# Altium project SCOM_CCM_JLC_STACKUP.PrjPcb
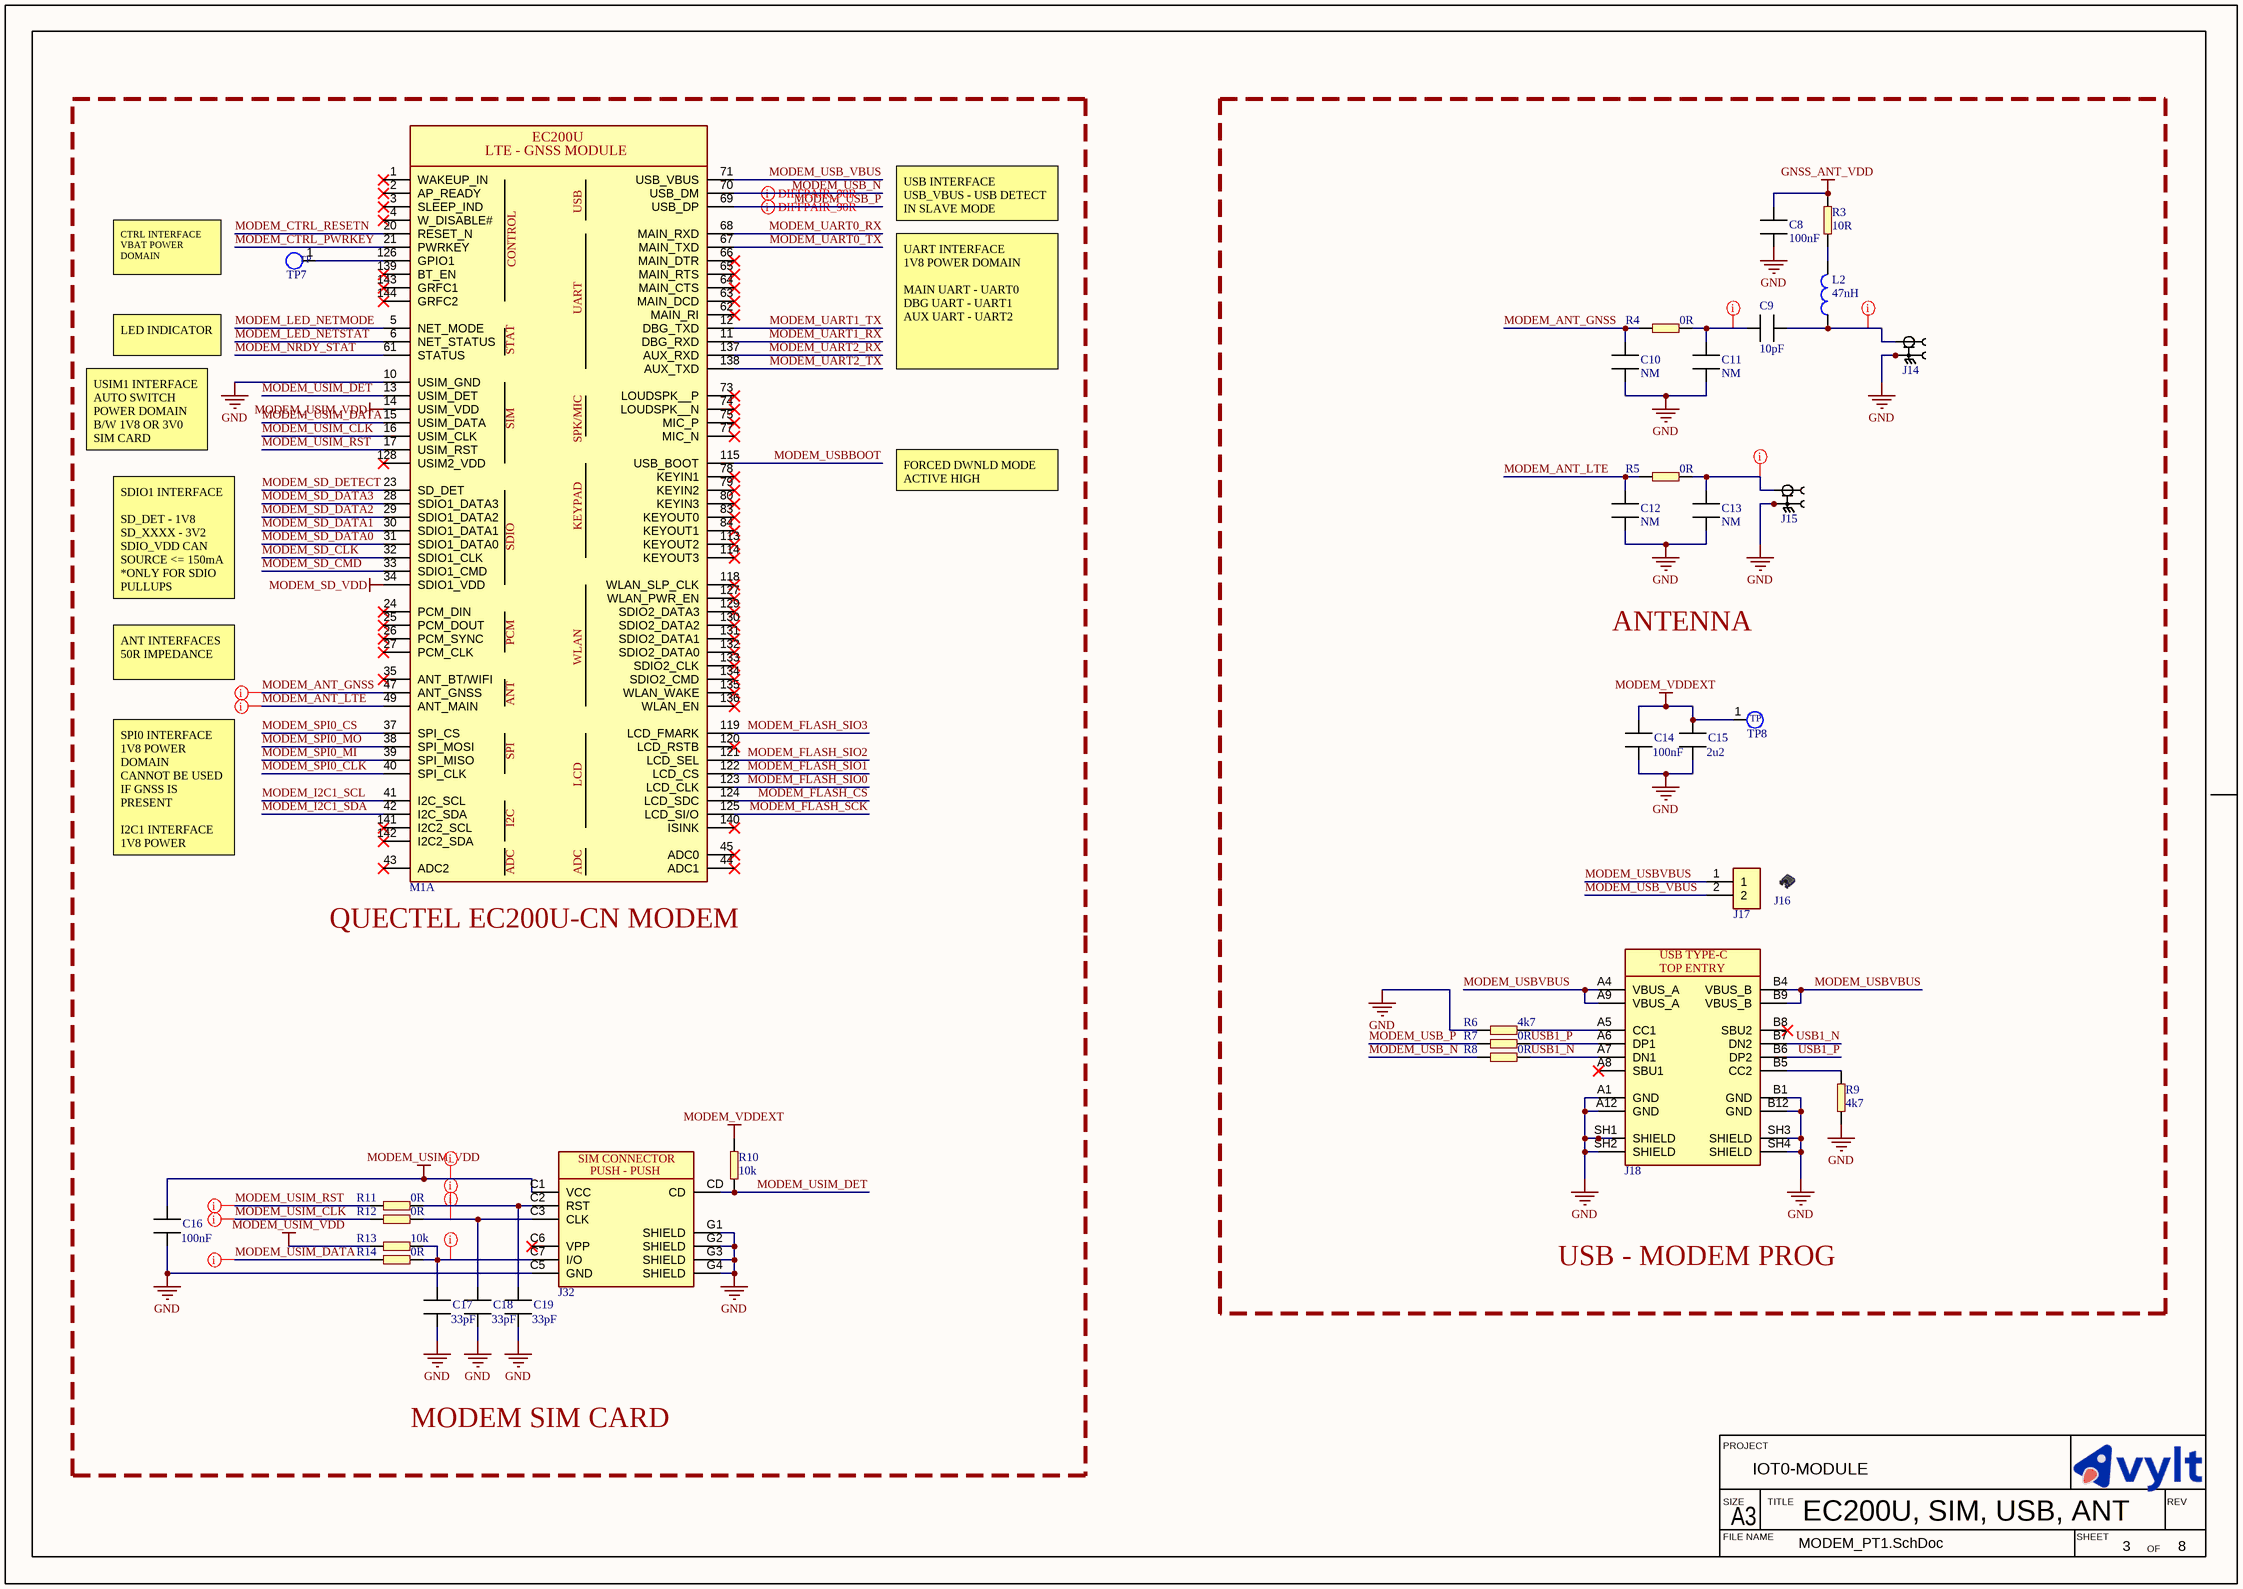
[diagram p0: MODEM_PT1.SchDoc]
Project: IOT0-MODULE; Rev: 1.0; SheetTotal: 8
3 sheets, 82 parts. Net scope: global (net labels, ports and power ports of the same name join across sheets).
Board file: SCOM_CCM_JLC_STACKUP.PcbDoc
Sheets:
  MODEM_PT1.SchDoc
  STORAGE.SchDoc
  MCU.SchDoc

## Sheet MODEM_PT1.SchDoc: EC200U, SIM, USB, ANT
size 420 x 297 mm; Revision: 1.0; SheetNumber: 3

### Parts
C8  value 100nF  [CAPC2012X13L]  (hidden comment: MLCC_0805)  (no BOM)
C9  value 10pF  [CAPC0603X03L]  (hidden comment: ERP_102-1)
C10  value NM  [CAPC0603X03L]  (hidden comment: ERP_102-1)  (no BOM)
C11  value NM  [CAPC0603X03L]  (hidden comment: ERP_102-1)  (no BOM)
C12  value NM  [CAPC0603X03L]  (hidden comment: ERP_102-1)  (no BOM)
C13  value NM  [CAPC0603X03L]  (hidden comment: ERP_102-1)  (no BOM)
C14  value 100nF  [CAPC2012X13L]  (hidden comment: MLCC_0805)
C15  value 2u2  [CAPC2012X13L]  (hidden comment: MLCC_0805)
C16  value 100nF  [CAPC2012X13L]  (hidden comment: MLCC_0805)
C17  value 33pF  [CAPC2012X13L]  (hidden comment: MLCC_0805)
C18  value 33pF  [CAPC2012X13L]  (hidden comment: MLCC_0805)
C19  value 33pF  [CAPC2012X13L]  (hidden comment: MLCC_0805)
J14  ERP_148-1  [uFL_50R]  (value not drawn)
J15  ERP_148-1  [uFL_50R]  (value not drawn)
J16  Jumper Cap  (value not drawn)  (mechanical)
J17  2PX1R  [2PX1R]  (value not drawn)
J18  GSB1CA11101DSHR  [GSB1CA11101DSHR]  (value not drawn)
J32  MUP-7801-1  [MUP-7801-1]  (value not drawn)
L2  value 47nH  [IND_0603]  (hidden comment: ERP_103-3)
M1  EC200U  [EC200U]  (value not drawn)  (part A of 2)
R3  value 10R  [RES_0603]  (hidden comment: ERP_101-1)
R4  value 0R  [RESC0603X03L]  (hidden comment: ERP_101-1)
R5  value 0R  [RESC0603X03L]  (hidden comment: ERP_101-1)
R6  value 4k7  [RES_0603]  (hidden comment: ERP_101-1)
R7  value 0R  [RES_0603]  (hidden comment: ERP_101-1)
R8  value 0R  [RES_0603]  (hidden comment: ERP_101-1)
R9  value 4k7  [RES_0603]  (hidden comment: ERP_101-1)
R10  value 10k  [RES_0603]  (hidden comment: ERP_101-1)
R11  value 0R  [RES_0603]  (hidden comment: ERP_101-1)
R12  value 0R  [RES_0603]  (hidden comment: ERP_101-1)
R13  value 10k  [RES_0603]  (hidden comment: ERP_101-1)
R14  value 0R  [RES_0603]  (hidden comment: ERP_101-1)
TP7  TP_1MM  [TP_1MM]  (value not drawn)  (no BOM)
TP8  TP_1MM  [TP_1MM]  (value not drawn)  (no BOM)

### Nets
GND: C8.2 C10.1 C11.1 C12.1 C13.1 C14.2 C15.2 C16.2 C17.2 C18.2 C19.2 J14.1 J14.2 J15.1 J15.2 J18.A1(GND) J18.A12(GND) J18.B1(GND) J18.B12(GND) J18.SH1(SHIELD) J18.SH2(SHIELD) J18.SH3(SHIELD) J18.SH4(SHIELD) J32.C5(GND) J32.G1(SHIELD) J32.G2(SHIELD) J32.G3(SHIELD) J32.G4(SHIELD) M1.10(USIM_GND) R6.2 R9.2
GNSS_ANT_VDD: C8.1 R3.2
MODEM_SD_VDD: M1.34(SDIO1_VDD)
MODEM_USIM_VDD: C16.1 J32.C1(VCC) M1.14(USIM_VDD) R13.2
MODEM_VDDEXT: C14.1 C15.1 R10.2 TP8.1
MODEM_ANT_GNSS: C10.2 M1.47(ANT_GNSS) R4.2
MODEM_ANT_LTE: C12.2 M1.49(ANT_MAIN) R5.2
MODEM_CTRL_PWRKEY: M1.21(PWRKEY)
MODEM_CTRL_RESETN: M1.20(RESET_N)
MODEM_FLASH_CS: M1.124(LCD_SDC)
MODEM_FLASH_SCK: M1.125(LCD_SI/O)
MODEM_FLASH_SIO0: M1.123(LCD_CLK)
MODEM_FLASH_SIO1: M1.122(LCD_CS)
MODEM_FLASH_SIO2: M1.121(LCD_SEL)
MODEM_FLASH_SIO3: M1.119(LCD_FMARK)
MODEM_I2C1_SCL: M1.41(I2C_SCL)
MODEM_I2C1_SDA: M1.42(I2C_SDA)
MODEM_LED_NETMODE: M1.5(NET_MODE)
MODEM_LED_NETSTAT: M1.6(NET_STATUS)
MODEM_NRDY_STAT: M1.61(STATUS)
MODEM_SD_CLK: M1.32(SDIO1_CLK)
MODEM_SD_CMD: M1.33(SDIO1_CMD)
MODEM_SD_DATA0: M1.31(SDIO1_DATA0)
MODEM_SD_DATA1: M1.30(SDIO1_DATA1)
MODEM_SD_DATA2: M1.29(SDIO1_DATA2)
MODEM_SD_DATA3: M1.28(SDIO1_DATA3)
MODEM_SD_DETECT: M1.23(SD_DET)
MODEM_SPI0_CLK: M1.40(SPI_CLK)
MODEM_SPI0_CS: M1.37(SPI_CS)
MODEM_SPI0_MI: M1.39(SPI_MISO)
MODEM_SPI0_MO: M1.38(SPI_MOSI)
MODEM_UART0_RX: M1.68(MAIN_RXD)
MODEM_UART0_TX: M1.67(MAIN_TXD)
MODEM_UART1_RX: M1.11(DBG_RXD)
MODEM_UART1_TX: M1.12(DBG_TXD)
MODEM_UART2_RX: M1.137(AUX_RXD)
MODEM_UART2_TX: M1.138(AUX_TXD)
MODEM_USB_N: M1.70(USB_DM) R8.2
MODEM_USB_P: M1.69(USB_DP) R7.2
MODEM_USB_VBUS: J17.2 M1.71(USB_VBUS)
MODEM_USBBOOT: M1.115(USB_BOOT)
MODEM_USBVBUS: J17.1 J18.A4(VBUS_A) J18.A9(VBUS_A) J18.B4(VBUS_B) J18.B9(VBUS_B)
MODEM_USIM_CLK: M1.16(USIM_CLK) R12.2
MODEM_USIM_DATA: M1.15(USIM_DATA) R14.2
MODEM_USIM_DET: J32.CD M1.13(USIM_DET) R10.1
MODEM_USIM_RST: M1.17(USIM_RST) R11.2
USB1_N: J18.A7(DN1) J18.B7(DN2) R8.1
USB1_P: J18.A6(DP1) J18.B6(DP2) R7.1
NetC9_1: C9.1 J14.3 L2.1
NetC9_2: C9.2 C11.2 R4.1
NetC13_2: C13.2 J15.3 R5.1
NetC17_1: C17.1 J32.C7(I/O) R13.1 R14.1
NetC18_1: C18.1 J32.C3(CLK) R12.1
NetC19_1: C19.1 J32.C2(RST) R11.1
NetJ18_A5: J18.A5(CC1) R6.1
NetJ18_B5: J18.B5(CC2) R9.1
NetL2_2: L2.2 R3.1
NetM1_126: M1.126(GPIO1) TP7.1

Not connected (* = marked no-connect by the designer): J18 A8(SBU1)* B8(SBU2)*; J32 C6(VPP)*; M1 1(WAKEUP_IN)* 2(AP_READY)* 3(SLEEP_IND)* 4(W_DISABLE#)* 24(PCM_DIN)* 25(PCM_DOUT)* 26(PCM_SYNC)* 27(PCM_CLK)* 35(ANT_BT/WIFI)* 43(ADC2)* 44(ADC1)* 45(ADC0)* 62(MAIN_RI)* 63(MAIN_DCD)* 64(MAIN_CTS)* 65(MAIN_RTS)* 66(MAIN_DTR)* 73(LOUDSPK__P)* 74(LOUDSPK__N)* 75(MIC_P)* 77(MIC_N)* 78(KEYIN1)* 79(KEYIN2)* 80(KEYIN3)* 83(KEYOUT0)* 84(KEYOUT1)* 113(KEYOUT2)* 114(KEYOUT3)* 118(WLAN_SLP_CLK)* 120(LCD_RSTB)* 127(WLAN_PWR_EN)* 128(USIM2_VDD)* 129(SDIO2_DATA3)* 130(SDIO2_DATA2)* 131(SDIO2_DATA1)* 132(SDIO2_DATA0)* 133(SDIO2_CLK)* 134(SDIO2_CMD)* 135(WLAN_WAKE)* 136(WLAN_EN)* 139(BT_EN)* 140(ISINK)* 141(I2C2_SCL)* 142(I2C2_SDA)* 143(GRFC1)* 144(GRFC2)*

### Layout directives
differential pair; differential pair class USB_90R; rule Differential Pairs Routing [Pref Gap = 10mil    Min Gap  = 10mil    Max Gap  = 10milPref Width = 12.778mil    Min Width  = 12.778mil    Max Width  = 12.778mil]: MODEM_USB_N
differential pair; rule Differential Pairs Routing [Pref Gap = 10mil    Min Gap  = 10mil    Max Gap  = 10milPref Width = 12.778mil    Min Width  = 12.778mil    Max Width  = 12.778mil]; differential pair class USB_90R: MODEM_USB_P
net class ANT_50R; rule Width Constraint [Pref Impedance = 50.00ohms    Min Impedance = 50.00ohms    Max Impedance = 50.00ohms]: MODEM_ANT_GNSS, MODEM_ANT_LTE, NetC9_1, NetC9_2, NetC13_2
rule Width Constraint [Pref Impedance = 50.00ohms    Min Impedance = 50.00ohms    Max Impedance = 50.00ohms]: MODEM_USIM_CLK, MODEM_USIM_DATA, MODEM_USIM_RST, MODEM_USIM_VDD, NetC17_1, NetC18_1, NetC19_1

### Notes on the sheet
- USB INTERFACE
  USB_VBUS - USB DETECT IN SLAVE MODE
- CTRL INTERFACE
  VBAT POWER DOMAIN
- LED INDICATOR
- UART INTERFACE
  1V8 POWER DOMAIN
  MAIN UART - UART0
  DBG UART - UART1
  AUX UART - UART2
- USIM1 INTERFACE
  AUTO SWITCH POWER DOMAIN B/W 1V8 OR 3V0 SIM CARD
- FORCED DWNLD MODE
  ACTIVE HIGH
- SDIO1 INTERFACE
  SD_DET - 1V8
  SD_XXXX - 3V2
  SDIO_VDD CAN SOURCE <= 150mA
  *ONLY FOR SDIO PULLUPS
- ANTENNA
- ANT INTERFACES
  50R IMPEDANCE
- SPI0 INTERFACE
  1V8 POWER DOMAIN
  CANNOT BE USED IF GNSS IS PRESENT
  I2C1 INTERFACE
  1V8 POWER DOMAIN
- (near M1) QUECTEL EC200U-CN MODEM
- USB - MODEM PROG
- MODEM SIM CARD
- PROJECT
- SIZE
- FILE NAME
- A3
- TITLE
- SHEET
- OF
- REV
- (in symbol EC200U, part A) LTE - GNSS MODULE; USB; CONTROL; UART; STAT; SIM; SPK/MIC; KEYPAD; SDIO; PCM; WLAN; ANT; SPI; LCD; I2C; ADC
- (in symbol GSB1CA11101DSHR) USB TYPE-C; TOP ENTRY
- (in symbol MUP-7801-1) SIM CONNECTOR; PUSH - PUSH
- (in symbol TP_1MM) TP

### Library data of the parts
C8 C14-C19 = MLCC_0805: Chip Capacitor, 2-Leads, Body 2.00x1.25mm, IPC High Density; Package: 0805; Manufacturer 1: *; Manufacturer Part Number 1: *
C9-C13 = MLCC_0201: Chip Capacitor, 2-Leads, Body 0.60x0.30mm, IPC High Density; Package: 0201; Manufacturer 1: *; Manufacturer Part Number 1: *
J14 J15 = uFL_50R: Package: L3W3; Value: *; ERP: *; Manufacturer 1: *; Manufacturer Part Number 1: *; Supplier 1: *; Suuplier Part Number 1: *
J16 = Jumper Cap: 2 Pin Jumper Cap P2.54; Manufacturer Part Number 1: *; Manufacturer 1: *; Value: *
J18 = GSB1CA11101DSHR: USB-C (USB TYPE-C) USB 2.0 Receptacle Connector 24 (16+8 Dummy) Position Surface Mount, Through Hole; Manufacturer 1: Amphenol ICC (Commercial Products); Value: MUP-U23010-02; Manufacturer Part Number 1: GSB1CA11101DSHR; Package: 24 (16+8 Dummy)
J32 = MUP-7801-1: 7 (6 + 1) Position Card Connector NANO SIM Surface Mount, Right Angle Gold; Manufacturer Part Number 1: MUP-C7801-02; Manufacturer 1: MUP; Package: 7 (6 + 1); Value: *; Supplier Part Number 1: ST2103SD1921
L2 = IND_0603: ERP: *; Suuplier Part Number 1: *; Supplier 1: *; Manufacturer Part Number 1: *; Manufacturer 1: *; Package: 0603
M1 = EC200U: LTE CAT1 MODEM 144 SMD; Manufacturer 1: Quectel; Manufacturer Part Number 1: 027-EC200UCNAA-N05-SGNSA; Value: *
R3 R6-R14 = RES_0603: Package: 0603; Manufacturer 1: *; Manufacturer Part Number 1: *
R4 R5 = RES_0201: Package: 0201; Manufacturer 1: *; Manufacturer Part Number 1: *

## Sheet STORAGE.SchDoc: FLASH, SD CARD
size 420 x 297 mm; Revision: 1.0; SheetNumber: 5
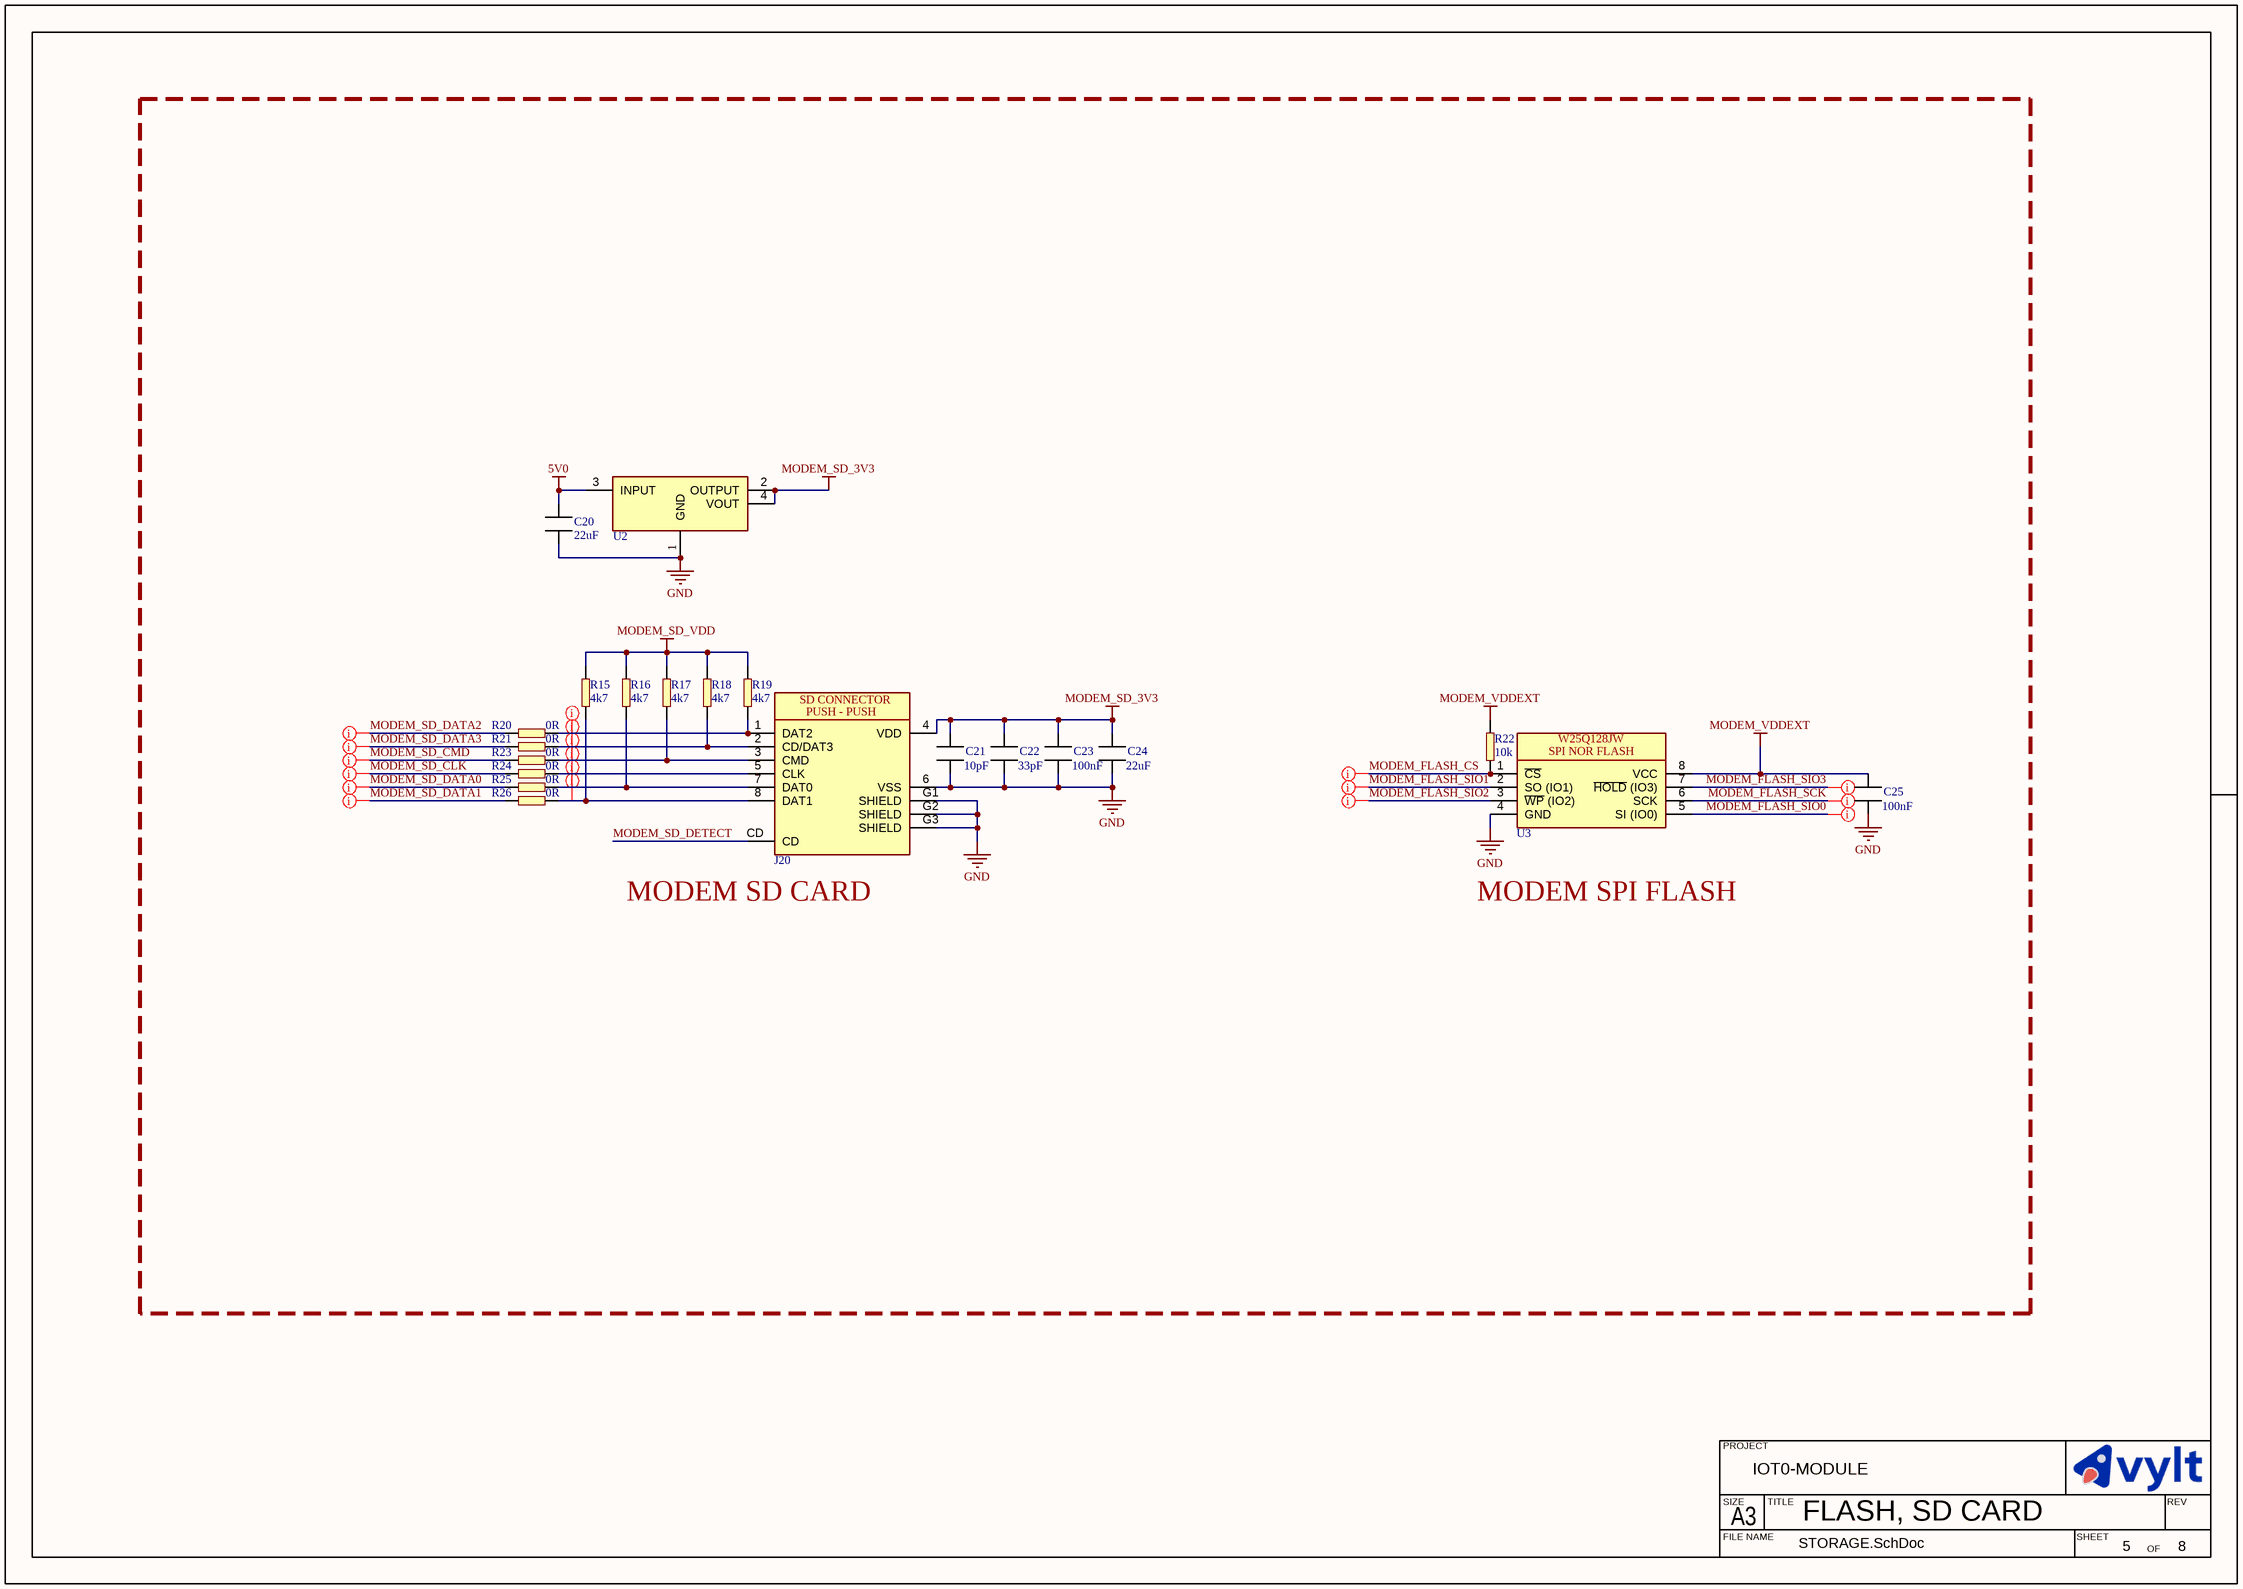
[diagram p1: STORAGE.SchDoc]

### Parts
C20  value 22uF  [CAPC2012X13L]  (hidden comment: MLCC_0805)
C21  value 10pF  [CAPC2012X13L]  (hidden comment: MLCC_0805)
C22  value 33pF  [CAPC2012X13L]  (hidden comment: MLCC_0805)
C23  value 100nF  [CAPC2012X13L]  (hidden comment: MLCC_0805)
C24  value 22uF  [CAPC2012X13L]  (hidden comment: MLCC_0805)
C25  value 100nF  [CAPC2012X13L]  (hidden comment: MLCC_0805)  (no BOM)
J20  GTFP084  [GTFP084]  (value not drawn)
R15  value 4k7  [RES_0603]  (hidden comment: ERP_101-1)
R16  value 4k7  [RES_0603]  (hidden comment: ERP_101-1)
R17  value 4k7  [RES_0603]  (hidden comment: ERP_101-1)
R18  value 4k7  [RES_0603]  (hidden comment: ERP_101-1)
R19  value 4k7  [RES_0603]  (hidden comment: ERP_101-1)
R20  value 0R  [RES_0603]  (hidden comment: ERP_101-1)  (no BOM)
R21  value 0R  [RES_0603]  (hidden comment: ERP_101-1)  (no BOM)
R22  value 10k  [RES_0603]  (hidden comment: ERP_101-1)  (no BOM)
R23  value 0R  [RES_0603]  (hidden comment: ERP_101-1)  (no BOM)
R24  value 0R  [RES_0603]  (hidden comment: ERP_101-1)  (no BOM)
R25  value 0R  [RES_0603]  (hidden comment: ERP_101-1)  (no BOM)
R26  value 0R  [RES_0603]  (hidden comment: ERP_101-1)  (no BOM)
U2  ERP_123-1  [AMS1117_SOT223]  (value not drawn)
U3  W25Q128JW  [SOIC127P800X216-8L]  (value not drawn)  (no BOM)

### Nets
5V0: C20.1 U2.3(INPUT)
GND: C20.2 C21.2 C22.2 C23.2 C24.2 C25.2 J20.6(VSS) J20.G1(SHIELD) J20.G2(SHIELD) J20.G3(SHIELD) U2.1(GND) U3.4(GND)
MODEM_SD_3V3: C21.1 C22.1 C23.1 C24.1 J20.4(VDD) U2.2(OUTPUT) U2.4(VOUT)
MODEM_SD_VDD: R15.2 R16.2 R17.2 R18.2 R19.2
MODEM_VDDEXT: C25.1 R22.2 U3.8(VCC)
MODEM_FLASH_CS: R22.1 U3.1(~{CS})
MODEM_FLASH_SCK: U3.6(SCK)
MODEM_FLASH_SIO0: U3.5(SI_(IO0))
MODEM_FLASH_SIO1: U3.2(SO_(IO1))
MODEM_FLASH_SIO2: U3.3(~{WP}_(IO2))
MODEM_FLASH_SIO3: U3.7(~{HOLD}_(IO3))
MODEM_SD_CLK: R24.2
MODEM_SD_CMD: R23.2
MODEM_SD_DATA0: R25.2
MODEM_SD_DATA1: R26.2
MODEM_SD_DATA2: R20.2
MODEM_SD_DATA3: R21.2
MODEM_SD_DETECT: J20.CD
NetJ20_1: J20.1(DAT2) R19.1 R20.1
NetJ20_2: J20.2(CD/DAT3) R18.1 R21.1
NetJ20_3: J20.3(CMD) R17.1 R23.1
NetJ20_5: J20.5(CLK) R24.1
NetJ20_7: J20.7(DAT0) R16.1 R25.1
NetJ20_8: J20.8(DAT1) R15.1 R26.1

### Layout directives
rule Width Constraint [Pref Impedance = 50.00ohms    Min Impedance = 50.00ohms    Max Impedance = 50.00ohms]: MODEM_FLASH_CS, MODEM_FLASH_SCK, MODEM_FLASH_SIO0, MODEM_FLASH_SIO1, MODEM_FLASH_SIO2, MODEM_FLASH_SIO3, MODEM_SD_CLK, MODEM_SD_CMD, MODEM_SD_DATA0, MODEM_SD_DATA1, MODEM_SD_DATA2, MODEM_SD_DATA3, NetJ20_1, NetJ20_2, NetJ20_3, NetJ20_5, NetJ20_7, NetJ20_8

### Notes on the sheet
- (near J20) MODEM SD CARD
- MODEM SPI FLASH
- PROJECT
- SIZE
- FILE NAME
- A3
- TITLE
- SHEET
- OF
- REV
- (in symbol GTFP084) SD CONNECTOR; PUSH - PUSH
- (in symbol W25Q128JW) SPI NOR FLASH

### Library data of the parts
C20-C25 = MLCC_0805: as C8 on sheet MODEM_PT1; Package: 0805; Manufacturer 1: *; Manufacturer Part Number 1: *
J20 = GTFP084: 9 (8 + 1) Position Card Connector Secure Digital - microSD™ Surface Mount, Right Angle Gold; Manufacturer Part Number 1: GTFP08431BEU; Manufacturer 1: Amphenol; Package: 9 (8+1); Value: *; Supplier Part Number 1: 6172
R15-R26 = RES_0603: Package: 0603; Manufacturer 1: *; Manufacturer Part Number 1: *
U2 = AMS1117_SOT223: AMS1117 LDO; Manufacturer 1: TI; Supplier  Part Number 1: *; Supplier  1: *; Package: SOT223; Manufacturer Part Number 1: *
U3 = W25Q128JW: FLASH - NOR Memory IC SPI - Quad I/O 133 MHz 8-SOIC; Manufacturer 1: Winbond; Manufacturer Part Number 1: W25Q128JWSIQ; Package: 8-SOIC; Value: *; Supplier Part Number 1: 153-W25Q128JWSIQ

## Sheet MCU.SchDoc: ESP32-PICO, STM32F4
size 420 x 297 mm; Revision: 1.0; SheetNumber: 6
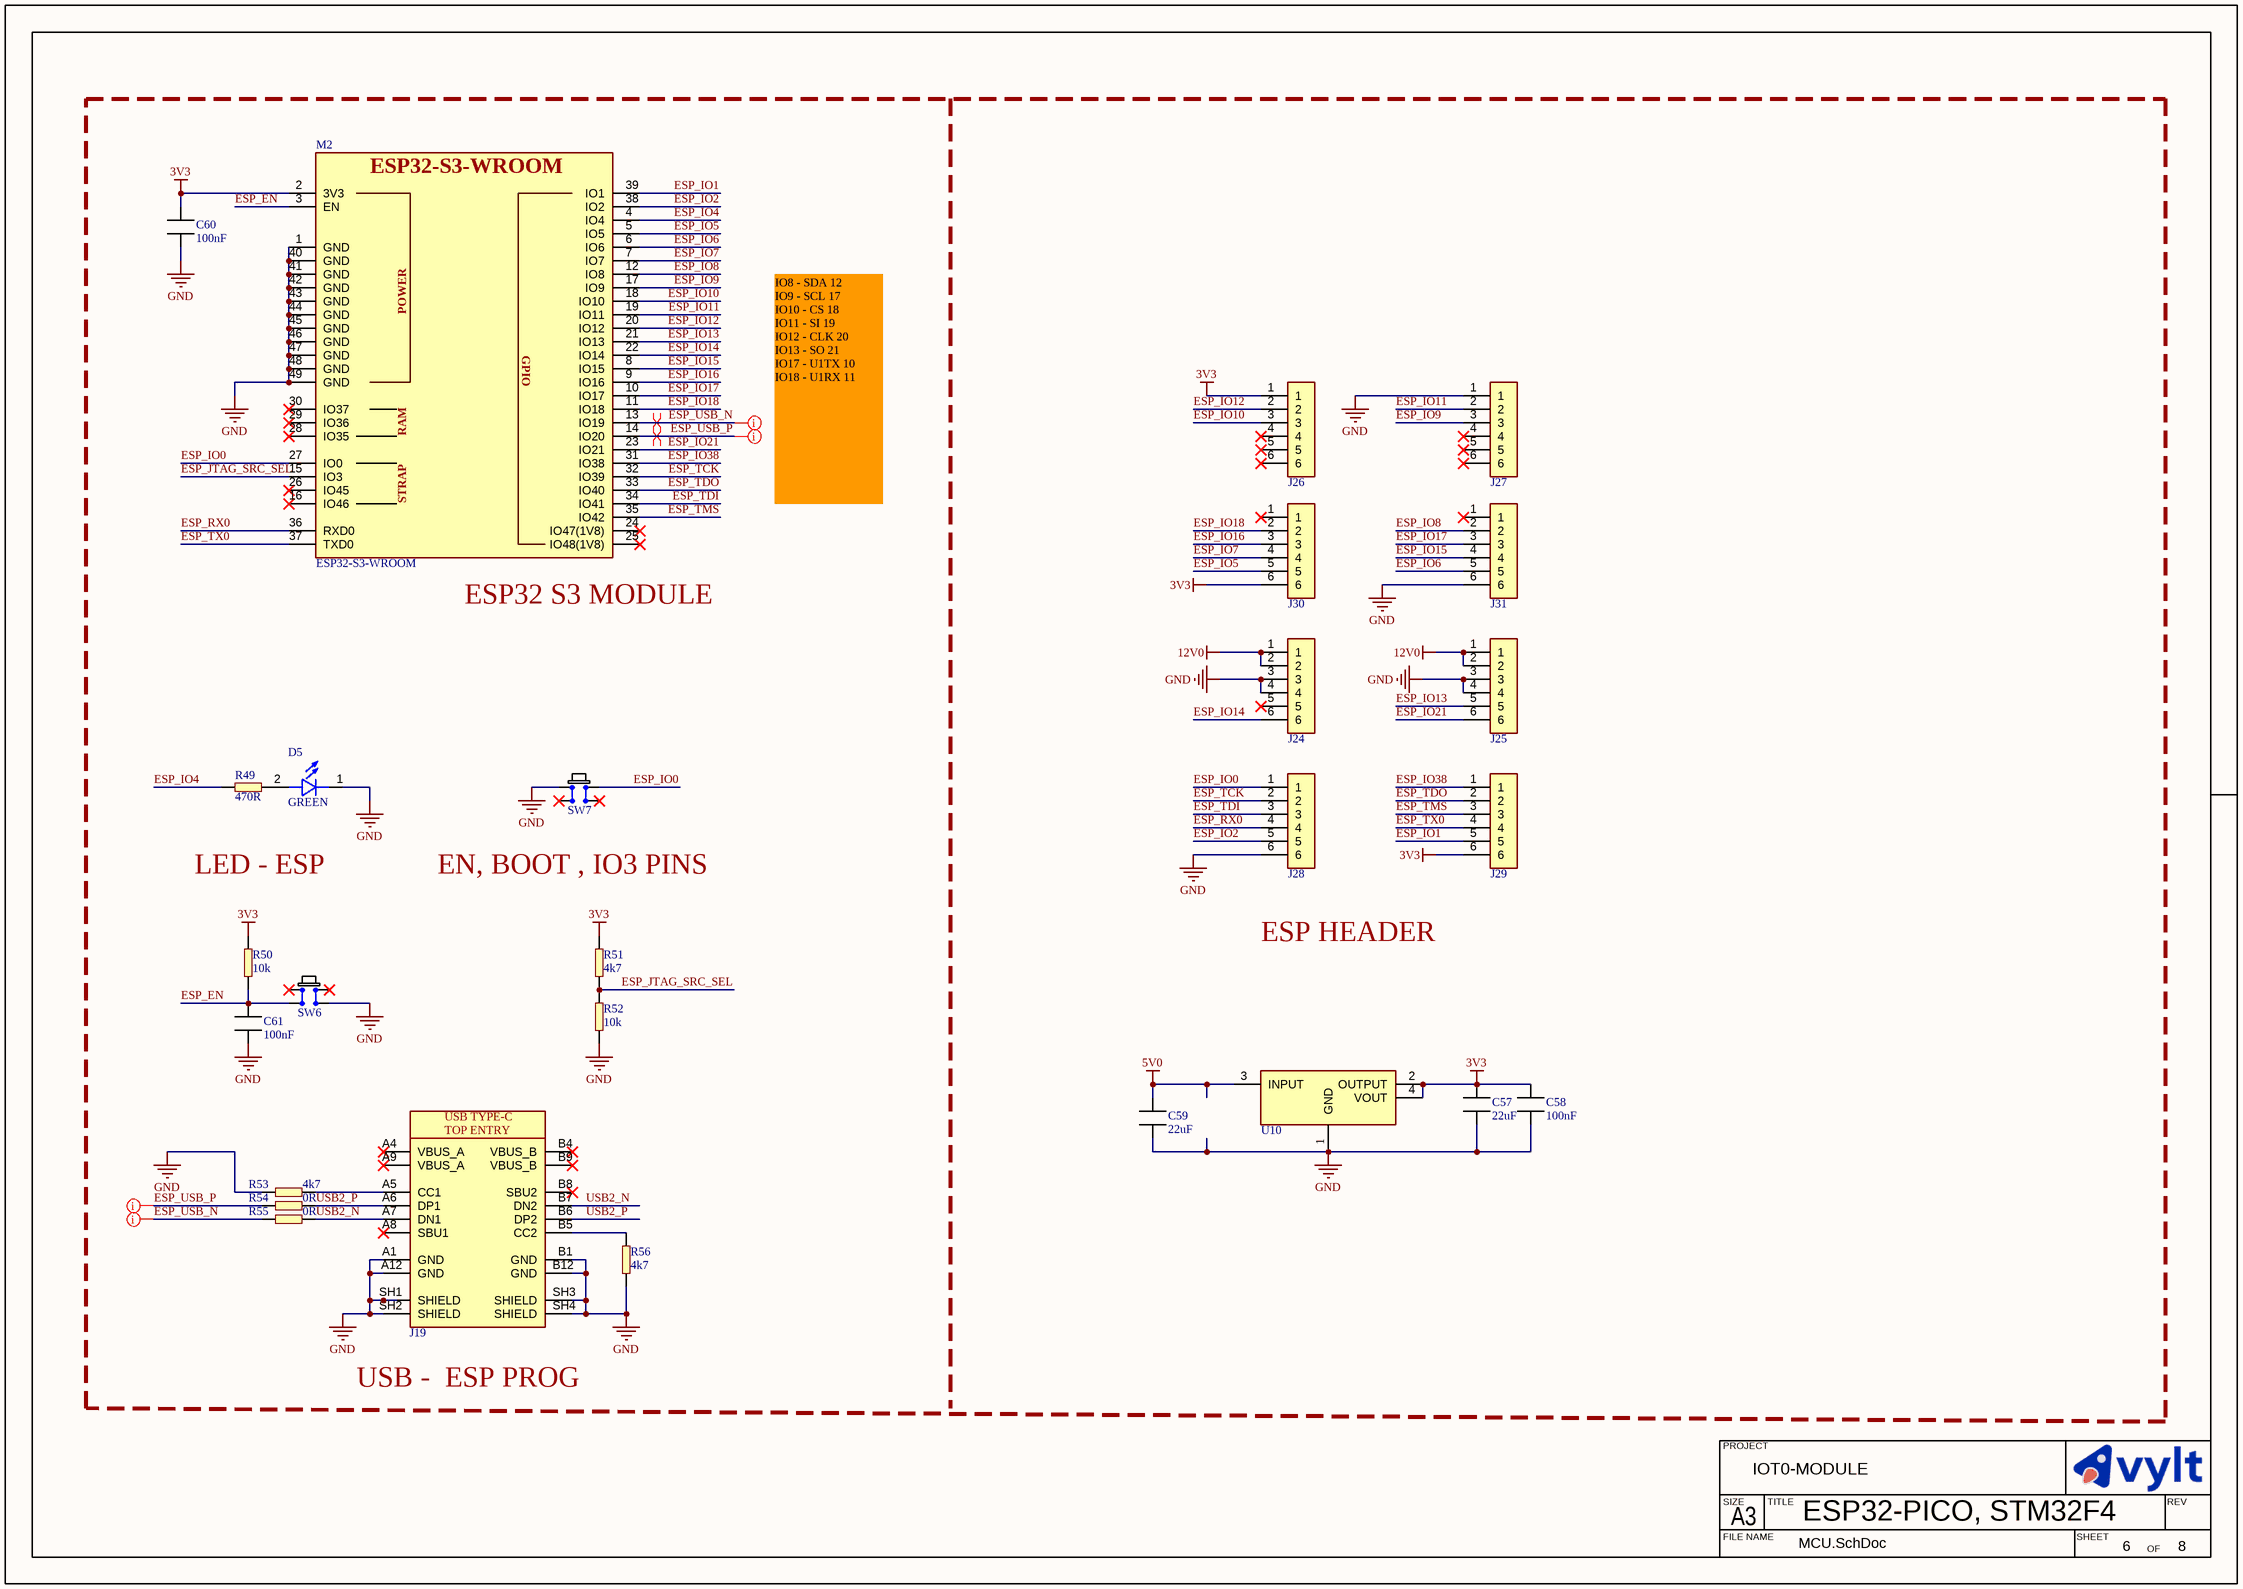
[diagram p2: MCU.SchDoc]

### Parts
C57  value 22uF  [CAPC2012X13L]  (hidden comment: MLCC_0805)
C58  value 100nF  [CAPC2012X13L]  (hidden comment: MLCC_0805)
C59  value 22uF  [CAPC2012X13L]  (hidden comment: MLCC_0805)
C60  value 100nF  [CAPC2012X13L]  (hidden comment: MLCC_0805)
C61  value 100nF  [CAPC2012X13L]  (hidden comment: MLCC_0805)
D5  value GREEN  [LED_1206]  (hidden comment: LED_1206)
J19  GSB1CA11101DSHR  [GSB1CA11101DSHR]  (value not drawn)
J24  ERP_148-2  [6PX1R_F]  (value not drawn)
J25  ERP_148-2  [6PX1R_F]  (value not drawn)
J26  ERP_148-2  [6PX1R_F]  (value not drawn)
J27  ERP_148-2  [6PX1R_F]  (value not drawn)
J28  ERP_148-2  [6PX1R_F]  (value not drawn)
J29  ERP_148-2  [6PX1R_F]  (value not drawn)
J30  ERP_148-2  [6PX1R_F]  (value not drawn)
J31  ERP_148-2  [6PX1R_F]  (value not drawn)
M2  value ESP32-S3-WROOM  [ESP32-S3-WROOM-1]  (hidden comment: ESP32-S3-WROOM-1(U))
R49  value 470R  [RES_0603]  (hidden comment: ERP_101-1)
R50  value 10k  [RES_0603]  (hidden comment: ERP_101-1)
R51  value 4k7  [RES_0603]  (hidden comment: ERP_101-1)
R52  value 10k  [RES_0603]  (hidden comment: ERP_101-1)
R53  value 4k7  [RES_0603]  (hidden comment: ERP_101-1)
R54  value 0R  [RES_0603]  (hidden comment: ERP_101-1)
R55  value 0R  [RES_0603]  (hidden comment: ERP_101-1)
R56  value 4k7  [RES_0603]  (hidden comment: ERP_101-1)
SW6  Generic6X6  [Generic6X6]  (value not drawn)
SW7  Generic6X6  [Generic6X6]  (value not drawn)
U10  ERP_123-1  [AMS1117_SOT223]  (value not drawn)

### Nets
3V3: C57.1 C58.1 C60.1 J26.1 J29.6 J30.6 M2.2(3V3) R50.2 R51.2 U10.2(OUTPUT) U10.4(VOUT)
5V0: C59.1 U10.3(INPUT)
12V0: J24.1 J24.2 J25.1 J25.2
GND: C57.2 C58.2 C59.2 C60.2 C61.2 D5.1 J19.A1(GND) J19.A12(GND) J19.B1(GND) J19.B12(GND) J19.SH1(SHIELD) J19.SH2(SHIELD) J19.SH3(SHIELD) J19.SH4(SHIELD) J24.3 J24.4 J25.3 J25.4 J27.1 J28.6 J31.6 M2.1(GND) M2.40(GND) M2.41(GND) M2.42(GND) M2.43(GND) M2.44(GND) M2.45(GND) M2.46(GND) M2.47(GND) M2.48(GND) M2.49(GND) R52.1 R53.2 R56.2 SW6.4(COM) SW7.1(NO) U10.1(GND)
ESP_EN: C61.1 M2.3(EN) R50.1 SW6.2(NO)
ESP_IO0: J28.1 M2.27(IO0) SW7.3(COM)
ESP_IO1: J29.5 M2.39(IO1)
ESP_IO2: J28.5 M2.38(IO2)
ESP_IO4: M2.4(IO4) R49.2
ESP_IO5: J30.5 M2.5(IO5)
ESP_IO6: J31.5 M2.6(IO6)
ESP_IO7: J30.4 M2.7(IO7)
ESP_IO8: J31.2 M2.12(IO8)
ESP_IO9: J27.3 M2.17(IO9)
ESP_IO10: J26.3 M2.18(IO10)
ESP_IO11: J27.2 M2.19(IO11)
ESP_IO12: J26.2 M2.20(IO12)
ESP_IO13: J25.5 M2.21(IO13)
ESP_IO14: J24.6 M2.22(IO14)
ESP_IO15: J31.4 M2.8(IO15)
ESP_IO16: J30.3 M2.9(IO16)
ESP_IO17: J31.3 M2.10(IO17)
ESP_IO18: J30.2 M2.11(IO18)
ESP_IO21: J25.6 M2.23(IO21)
ESP_IO38: J29.1 M2.31(IO38)
ESP_JTAG_SRC_SEL: M2.15(IO3) R51.1 R52.2
ESP_RX0: J28.4 M2.36(RXD0)
ESP_TCK: J28.2 M2.32(IO39)
ESP_TDI: J28.3 M2.34(IO41)
ESP_TDO: J29.2 M2.33(IO40)
ESP_TMS: J29.3 M2.35(IO42)
ESP_TX0: J29.4 M2.37(TXD0)
ESP_USB_N: M2.13(IO19) R55.2
ESP_USB_P: M2.14(IO20) R54.2
USB2_N: J19.A7(DN1) J19.B7(DN2) R55.1
USB2_P: J19.A6(DP1) J19.B6(DP2) R54.1
NetD5_2: D5.2 R49.1
NetJ19_A5: J19.A5(CC1) R53.1
NetJ19_B5: J19.B5(CC2) R56.1

Not connected (* = marked no-connect by the designer): J19 A4(VBUS_A)* A8(SBU1)* A9(VBUS_A)* B4(VBUS_B)* B8(SBU2)* B9(VBUS_B)*; J24 5*; J26 4* 5* 6*; J27 4* 5* 6*; J30 1*; J31 1*; M2 16(IO46)* 24(IO47(1V8))* 25(IO48(1V8))* 26(IO45)* 28(IO35)* 29(IO36)* 30(IO37)*; SW6 1(NO)* 3(COM)*; SW7 2(NO)* 4(COM)*

### Layout directives
rule Differential Pairs Routing [Pref Gap = 10mil    Min Gap  = 10mil    Max Gap  = 10milPref Width = 12.778mil    Min Width  = 12.778mil    Max Width  = 12.778mil]; rule Routing Via Style [Pref Size = 0.7mm    Pref Hole Size = 0.4mm]: ESP_USB_N, ESP_USB_P
differential pair: ESP_USB_N, ESP_USB_P
rule Differential Pairs Routing [Pref Gap = 10mil    Min Gap  = 10mil    Max Gap  = 10milPref Width = 12.778mil    Min Width  = 12.778mil    Max Width  = 12.778mil]: ESP_USB_N, ESP_USB_P

### Notes on the sheet
- IO8 - SDA 12
  IO9 - SCL 17
  IO10 - CS 18
  IO11 - SI 19
  IO12 - CLK 20
  IO13 - SO 21
  IO17 - U1TX 10
  IO18 - U1RX 11
- (near M2) ESP32 S3 MODULE
- LED - ESP
- EN, BOOT , IO3 PINS
- ESP HEADER
- (near J19) USB -  ESP PROG
- PROJECT
- SIZE
- FILE NAME
- A3
- TITLE
- SHEET
- OF
- REV
- (in symbol ESP32-S3-WROOM-1(U)) POWER; GPIO; RAM; STRAP
- (in symbol GSB1CA11101DSHR) USB TYPE-C; TOP ENTRY

### Library data of the parts
C57-C61 = MLCC_0805: as C8 on sheet MODEM_PT1; Package: 0805; Manufacturer 1: *; Manufacturer Part Number 1: *
D5 = LED_1206: LED CLEAR 1206 SMD; Manufacturer Part Number 1: 6395; Manufacturer 1: Sunrom
J19 = GSB1CA11101DSHR: as J18 on sheet MODEM_PT1; Manufacturer Part Number 1: GSB1CA11101DSHR; Package: 24 (16+8 Dummy)
J24-J31 = 6PX1R_F: 6PX1R Female Header; Value: *; Manufacturer 1: *; Manufacturer Part Number 1: *
M2 = ESP32-S3-WROOM-1(U): ESP32-S3-WROOM 1/1U Module; Manufacturer 1: Espressif Systems; Manufacturer Part Number 1: *; Package: *
R49-R56 = RES_0603: Package: 0603; Manufacturer 1: *; Manufacturer Part Number 1: *
  R49: ERP: *
SW6 SW7 = Generic6X6: Tactile Switch SPST-NO Top Actuated Surface Mount; Manufacturer 1: C&K; Manufacturer Part Number 1: *; Package: 4.5X4.5
U10 = AMS1117_SOT223: AMS1117 LDO; Manufacturer 1: TI; Supplier  Part Number 1: *; Supplier  1: *; Package: SOT223; Manufacturer Part Number 1: *

## Nets that join several sheets
5V0: STORAGE (C20.1 U2.3), MCU (C59.1 U10.3)
GND: MODEM_PT1 (31 pins), STORAGE (12 pins), MCU (38 pins)
MODEM_SD_VDD: MODEM_PT1 (M1.34), STORAGE (5 pins)
MODEM_VDDEXT: MODEM_PT1 (C14.1 C15.1 R10.2 TP8.1), STORAGE (C25.1 R22.2 U3.8)
MODEM_FLASH_CS: MODEM_PT1 (M1.124), STORAGE (R22.1 U3.1)
MODEM_FLASH_SCK: MODEM_PT1 (M1.125), STORAGE (U3.6)
MODEM_FLASH_SIO0: MODEM_PT1 (M1.123), STORAGE (U3.5)
MODEM_FLASH_SIO1: MODEM_PT1 (M1.122), STORAGE (U3.2)
MODEM_FLASH_SIO2: MODEM_PT1 (M1.121), STORAGE (U3.3)
MODEM_FLASH_SIO3: MODEM_PT1 (M1.119), STORAGE (U3.7)
MODEM_SD_CLK: MODEM_PT1 (M1.32), STORAGE (R24.2)
MODEM_SD_CMD: MODEM_PT1 (M1.33), STORAGE (R23.2)
MODEM_SD_DATA0: MODEM_PT1 (M1.31), STORAGE (R25.2)
MODEM_SD_DATA1: MODEM_PT1 (M1.30), STORAGE (R26.2)
MODEM_SD_DATA2: MODEM_PT1 (M1.29), STORAGE (R20.2)
MODEM_SD_DATA3: MODEM_PT1 (M1.28), STORAGE (R21.2)
MODEM_SD_DETECT: MODEM_PT1 (M1.23), STORAGE (J20.CD)